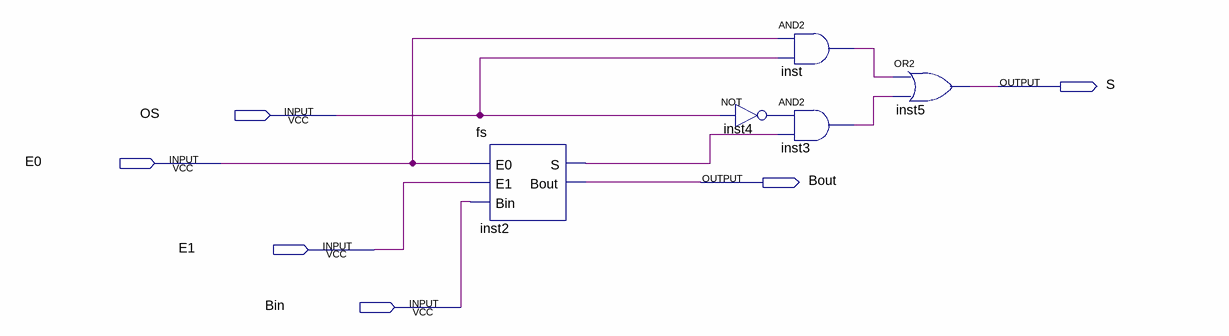
[diagram p0: schematic sheet]
// Quartus schematic unidade_subtratora.bdf as structural Verilog: 5 symbols, 6 pins
module unidade_subtratora (
  input  OS,
  input  E0,
  input  E1,
  input  Bin,
  output S,
  output Bout
);

  wire inst2_s, inst3_out, inst4_out, inst_out;

  fs inst2 (.E0(E0), .E1(E1), .Bin(Bin), .S(inst2_s), .Bout(Bout));
  not inst4 (inst4_out, OS);
  and inst (inst_out, E0, OS);
  and inst3 (inst3_out, inst4_out, inst2_s);
  or inst5 (S, inst_out, inst3_out);
endmodule
